# EasyEDA schematic SCH_Wavu_2025-10-24.json
TITLE: Sheet_1; REV: 1.0; Date: 2025-08-17; Sheet: 1/1; Drawn By: rudravenommishra; Company: Your Company
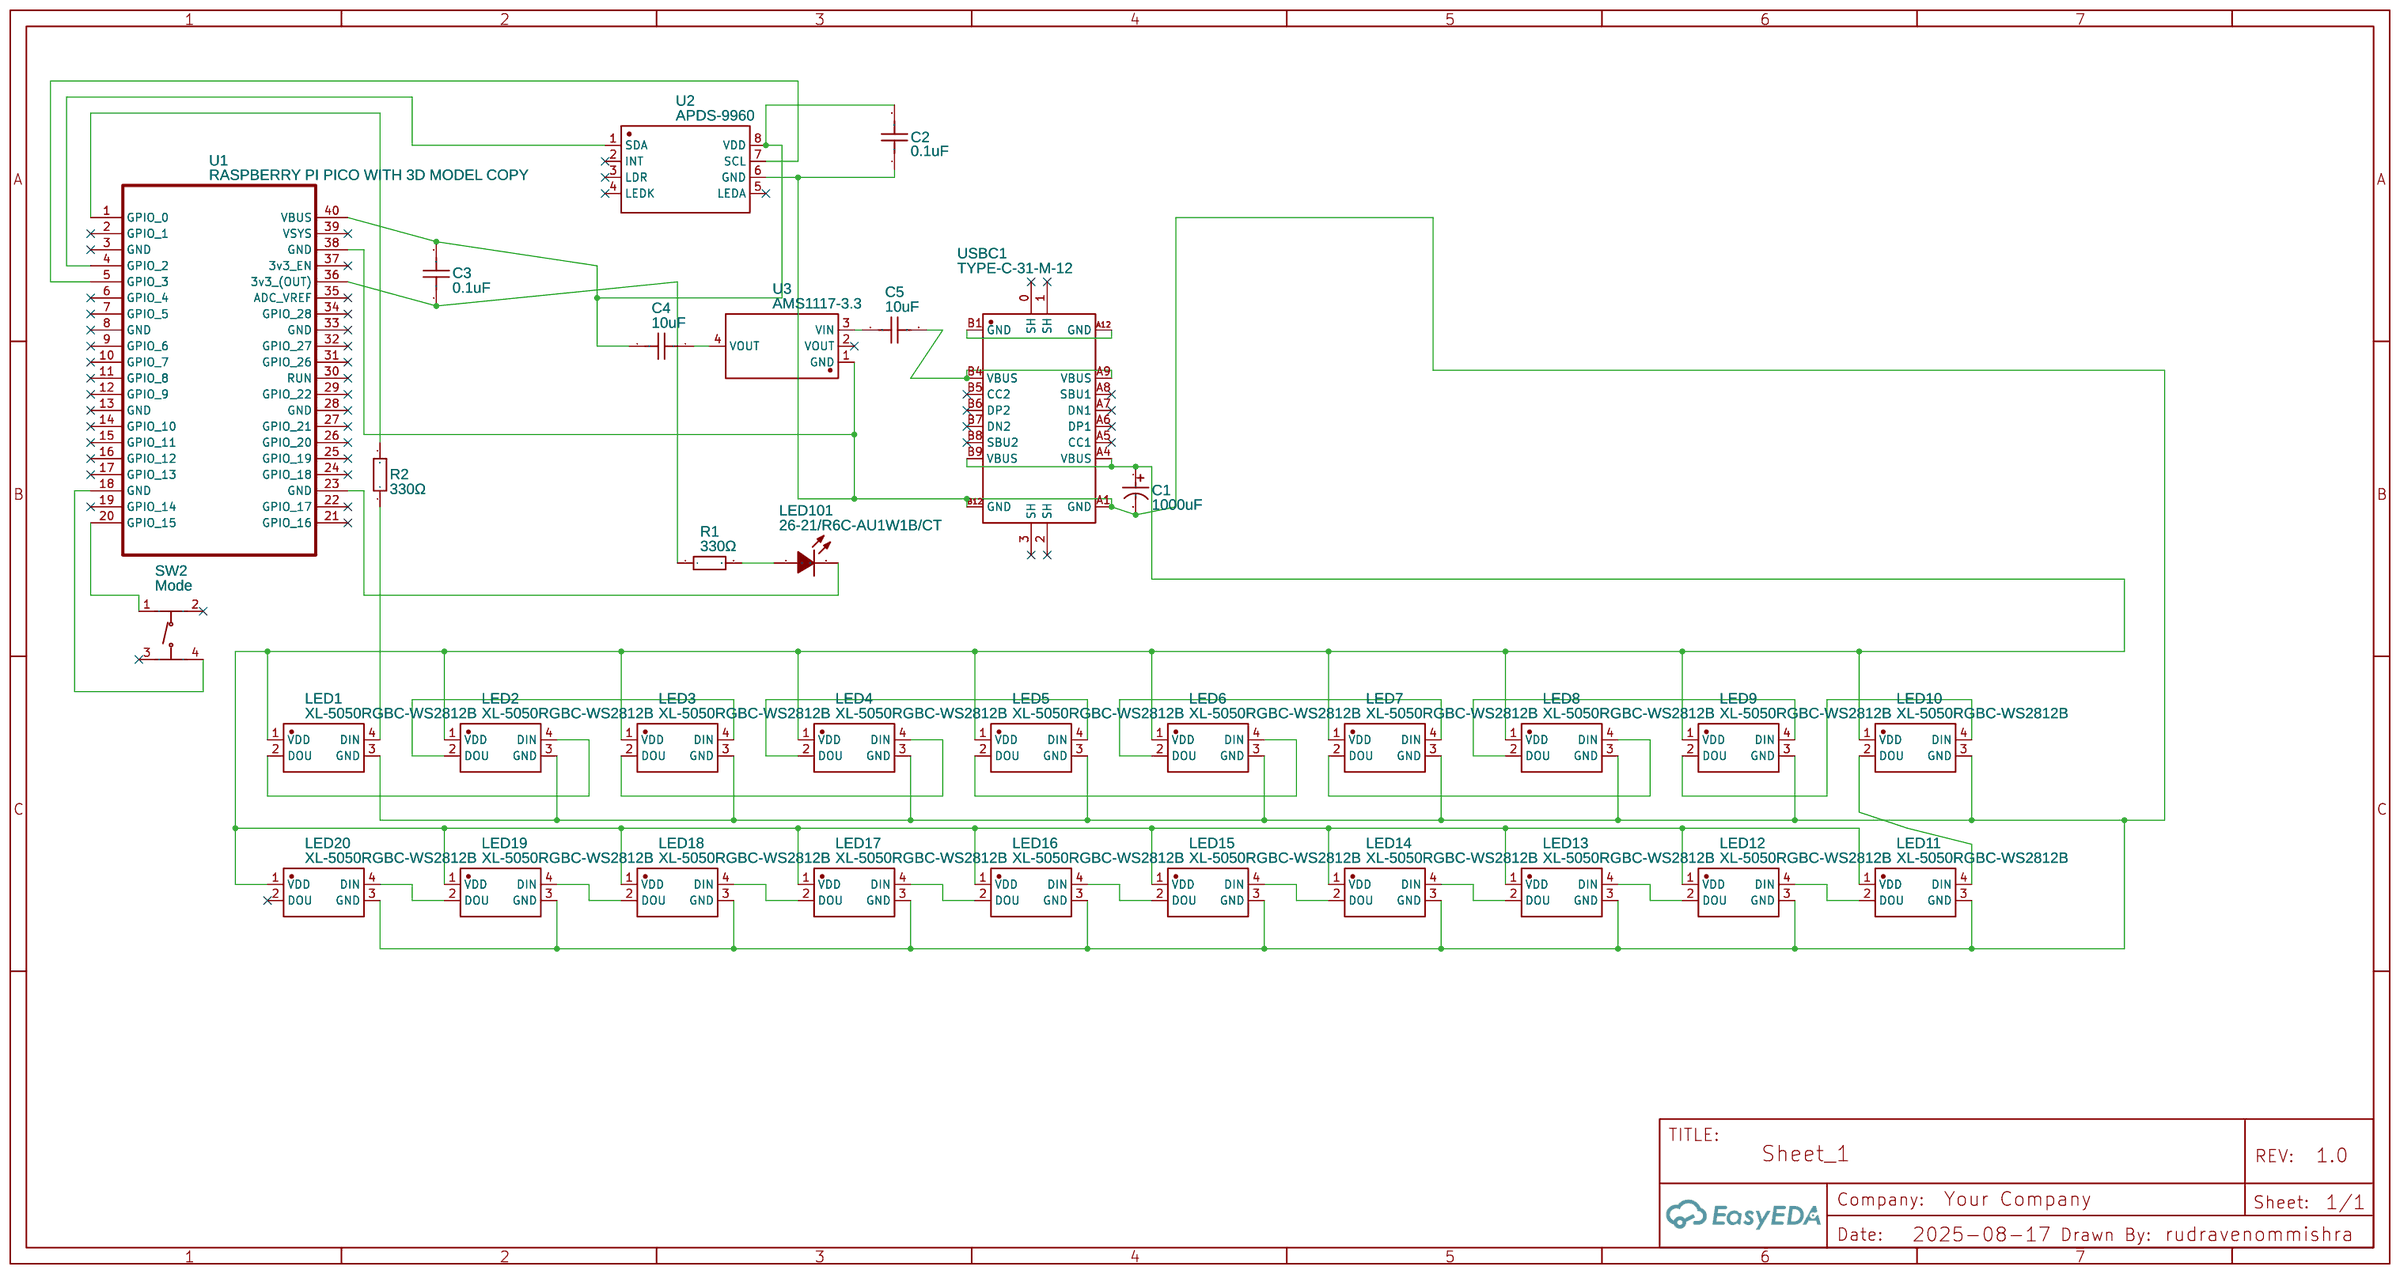
[diagram p0: schematic sheet]

## Parts
C1  1000uF  [CAP-TH_BD10.0-P5.00-D1.0-FD]
C2  0.1uF  [C0805]
C3  0.1uF  [C0805]
C4  10uF  [C0805]
C5  10uF  [C0805]
LED1  XL-5050RGBC-WS2812B  [LED-SMD_4P-L5.0-W5.0-BL_XL-5050RGBC]
LED2  XL-5050RGBC-WS2812B  [LED-SMD_4P-L5.0-W5.0-BL_XL-5050RGBC]
LED3  XL-5050RGBC-WS2812B  [LED-SMD_4P-L5.0-W5.0-BL_XL-5050RGBC]
LED4  XL-5050RGBC-WS2812B  [LED-SMD_4P-L5.0-W5.0-BL_XL-5050RGBC]
LED5  XL-5050RGBC-WS2812B  [LED-SMD_4P-L5.0-W5.0-BL_XL-5050RGBC]
LED6  XL-5050RGBC-WS2812B  [LED-SMD_4P-L5.0-W5.0-BL_XL-5050RGBC]
LED7  XL-5050RGBC-WS2812B  [LED-SMD_4P-L5.0-W5.0-BL_XL-5050RGBC]
LED8  XL-5050RGBC-WS2812B  [LED-SMD_4P-L5.0-W5.0-BL_XL-5050RGBC]
LED9  XL-5050RGBC-WS2812B  [LED-SMD_4P-L5.0-W5.0-BL_XL-5050RGBC]
LED10  XL-5050RGBC-WS2812B  [LED-SMD_4P-L5.0-W5.0-BL_XL-5050RGBC]
LED11  XL-5050RGBC-WS2812B  [LED-SMD_4P-L5.0-W5.0-BL_XL-5050RGBC]
LED12  XL-5050RGBC-WS2812B  [LED-SMD_4P-L5.0-W5.0-BL_XL-5050RGBC]
LED13  XL-5050RGBC-WS2812B  [LED-SMD_4P-L5.0-W5.0-BL_XL-5050RGBC]
LED14  XL-5050RGBC-WS2812B  [LED-SMD_4P-L5.0-W5.0-BL_XL-5050RGBC]
LED15  XL-5050RGBC-WS2812B  [LED-SMD_4P-L5.0-W5.0-BL_XL-5050RGBC]
LED16  XL-5050RGBC-WS2812B  [LED-SMD_4P-L5.0-W5.0-BL_XL-5050RGBC]
LED17  XL-5050RGBC-WS2812B  [LED-SMD_4P-L5.0-W5.0-BL_XL-5050RGBC]
LED18  XL-5050RGBC-WS2812B  [LED-SMD_4P-L5.0-W5.0-BL_XL-5050RGBC]
LED19  XL-5050RGBC-WS2812B  [LED-SMD_4P-L5.0-W5.0-BL_XL-5050RGBC]
LED20  XL-5050RGBC-WS2812B  [LED-SMD_4P-L5.0-W5.0-BL_XL-5050RGBC]
LED101  26-21/R6C-AU1W1B/CT  [LED1206-R-RD_RED]
R1  330Ω  [R0805]
R2  330Ω  [R0805]
SW2  Mode  [SW-SMD_4P-L5.1-W5.1-P3.70-LS6.5-TL_H1.5]
U1  RASPBERRY PI PICO WITH 3D MODEL COPY  [RASPBERRY PI PICO/ RASPBERRY PI PICO W]
U2  APDS-9960  [SENSORS-SMD_APDS-9960]
U3  AMS1117-3.3  [SOT-223-3_L6.5-W3.4-P2.30-LS7.0-BR]
USBC1  TYPE-C-31-M-12  [USB-C_SMD-TYPE-C-31-M-12]

## Library data of the parts
C1 = 1000uF 10V 10*15: Supplier: LCSC; Manufacturer: CX(承兴); Manufacturer Part: GR108M010G15RR0VL4FP0; Supplier Part: C43339; JLCPCB Part Class: Extended Part
C2 C3 = CC0805KRX7R9BB104: Supplier: LCSC; Manufacturer: YAGEO(国巨); Supplier Part: C49678; JLCPCB Part Class: Basic Part
C4 C5 = V106K0805X5R250NHP: Contributor: lcsc; Supplier: LCSC; Supplier Part: C5240379; Manufacturer: VIIYONG(微容); JLCPCB Part Class: Extended Part
LED1-LED20 = XL-5050RGBC-WS2812B: Contributor: LCSC; Supplier: LCSC; Supplier Part: C2843785; Manufacturer: XINGLIGHT(成兴光); JLCPCB Part Class: Extended Part
LED101 = 26-21/R6C-AU1W1B/CT: Contributor: LCSC; Supplier: LCSC; Supplier Part: C131252; Manufacturer: EVERLIGHT(亿光); JLCPCB Part Class: Extended Part
R1 R2 = 0805W8F3300T5E: Supplier: LCSC; Manufacturer: UNI-ROYAL(厚声); Supplier Part: C17630; JLCPCB Part Class: Basic Part
SW2 = TS-1187A-B-A-B: Contributor: LCSC; Supplier: LCSC; Supplier Part: C318884; Manufacturer: XKB Connectivity(中国星坤); JLCPCB Part Class: Basic Part
U1 = RASPBERRY PI PICO WITH 3D MODEL COPY: Contributor: Pitbuell94
U2 = APDS-9960: Contributor: LCSC; Supplier: LCSC; Manufacturer: Broadcom(博通); Supplier Part: C93222; JLCPCB Part Class: Extended Part
U3 = AMS1117-3.3: sourceId: dwIGgezVh; Supplier: LCSC; Manufacturer: AMS; Supplier Part: C6186; JLCPCB Part Class: Basic Part
USBC1 = TYPE-C-31-M-12: Contributor: LCSC; Supplier: LCSC; Supplier Part: C165948; Manufacturer: 韩国韩荣; JLCPCB Part Class: Extended Part

## Nets
Net-(C1-1): C1.1 LED1.1(VDD) LED2.1(VDD) LED3.1(VDD) LED4.1(VDD) LED5.1(VDD) LED6.1(VDD) LED7.1(VDD) LED8.1(VDD) LED9.1(VDD) LED10.1(VDD) LED11.1(VDD) LED12.1(VDD) LED13.1(VDD) LED14.1(VDD) LED15.1(VDD) LED16.1(VDD) LED17.1(VDD) LED18.1(VDD) LED19.1(VDD) LED20.1(VDD) USBC1.A4(VBUS) USBC1.B9(VBUS)
Net-(C1-2): C1.2 C2.1 LED1.3(GND) LED2.3(GND) LED3.3(GND) LED4.3(GND) LED5.3(GND) LED6.3(GND) LED7.3(GND) LED8.3(GND) LED9.3(GND) LED10.3(GND) LED11.3(GND) LED12.3(GND) LED13.3(GND) LED14.3(GND) LED15.3(GND) LED16.3(GND) LED17.3(GND) LED18.3(GND) LED19.3(GND) LED20.3(GND) U1.38(GND) U2.6(GND) U3.1(GND) USBC1.A1(GND) USBC1.B12(GND)
Net-(C2-2): C2.2 C3.2 C4.1 U1.40(VBUS) U2.8(VDD)
Net-(C3-1): C3.1 R1.1 U1.36(3v3 (OUT))
Net-(C4-2): C4.2 U3.4(VOUT)
Net-(C5-1): C5.1 U3.3(VIN)
Net-(C5-2): C5.2 USBC1.A9(VBUS) USBC1.B4(VBUS)
Net-(LED1-2): LED1.2(DOU) LED2.4(DIN)
Net-(LED1-4): LED1.4(DIN) R2.1
Net-(LED2-2): LED2.2(DOU) LED3.4(DIN)
Net-(LED3-2): LED3.2(DOU) LED4.4(DIN)
Net-(LED4-2): LED4.2(DOU) LED5.4(DIN)
Net-(LED5-2): LED5.2(DOU) LED6.4(DIN)
Net-(LED6-2): LED6.2(DOU) LED7.4(DIN)
Net-(LED7-2): LED7.2(DOU) LED8.4(DIN)
Net-(LED8-2): LED8.2(DOU) LED9.4(DIN)
Net-(LED9-2): LED9.2(DOU) LED10.4(DIN)
Net-(LED10-2): LED10.2(DOU) LED11.4(DIN)
Net-(LED11-2): LED11.2(DOU) LED12.4(DIN)
Net-(LED12-2): LED12.2(DOU) LED13.4(DIN)
Net-(LED13-2): LED13.2(DOU) LED14.4(DIN)
Net-(LED14-2): LED14.2(DOU) LED15.4(DIN)
Net-(LED15-2): LED15.2(DOU) LED16.4(DIN)
Net-(LED16-2): LED16.2(DOU) LED17.4(DIN)
Net-(LED17-2): LED17.2(DOU) LED18.4(DIN)
Net-(LED18-2): LED18.2(DOU) LED19.4(DIN)
Net-(LED19-2): LED19.2(DOU) LED20.4(DIN)
Net-(LED101-1): LED101.1(A) R1.2
Net-(LED101-2): LED101.2(K) U1.23(GND)
Net-(R2-2): R2.2 U1.1(GPIO 0)
Net-(SW2-1): SW2.1(A) U1.20(GPIO 15)
Net-(SW2-4): SW2.4(D) U1.18(GND)
Net-(U1-4): U1.4(GPIO 2) U2.1(SDA)
Net-(U1-5): U1.5(GPIO 3) U2.7(SCL)
Net-(USBC1-A12): USBC1.A12(GND) USBC1.B1(GND)

Not connected (* = marked no-connect by the designer): LED20 2(DOU)*; SW2 2(B)* 3(C)*; U1 2(GPIO 1)* 3(GND)* 6(GPIO 4)* 7(GPIO 5)* 8(GND)* 9(GPIO 6)* 10(GPIO 7)* 11(GPIO 8)* 12(GPIO 9)* 13(GND)* 14(GPIO 10)* 15(GPIO 11)* 16(GPIO 12)* 17(GPIO 13)* 19(GPIO 14)* 21(GPIO 16)* 22(GPIO 17)* 24(GPIO 18)* 25(GPIO 19)* 26(GPIO 20)* 27(GPIO 21)* 28(GND)* 29(GPIO 22)* 30(RUN)* 31(GPIO 26)* 32(GPIO 27)* 33(GND)* 34(GPIO 28)* 35(ADC_VREF)* 37(3v3_EN)* 39(VSYS)*; U2 2(INT)* 3(LDR)* 4(LEDK)* 5(LEDA)*; U3 2(VOUT)*; USBC1 0(SH)* 1(SH)* 2(SH)* 3(SH)* A5(CC1)* A6(DP1)* A7(DN1)* A8(SBU1)* B5(CC2)* B6(DP2)* B7(DN2)* B8(SBU2)*
